# EAGLE design BSK1 (EAGLE 9.4.2)
ESKD_DESCRIPTION1: 207|235|224|242|224|32|193|209|202|49; ESKD_DESCRIPTION2: 241|245|229|236|224|32|253|235|229|234|242|240|232|247|229|241|234|224|255; ESKD_DESCRIPTION3: 239|240|232|237|246|232|239|232|224|235|252|237|224|255; ESKD_NUMBER: 67|67|83|50|46|50|50|48|48|45|48|221|51; ESKD_NUMBER_SHEET: 49; ESKD_SHEETS: 49
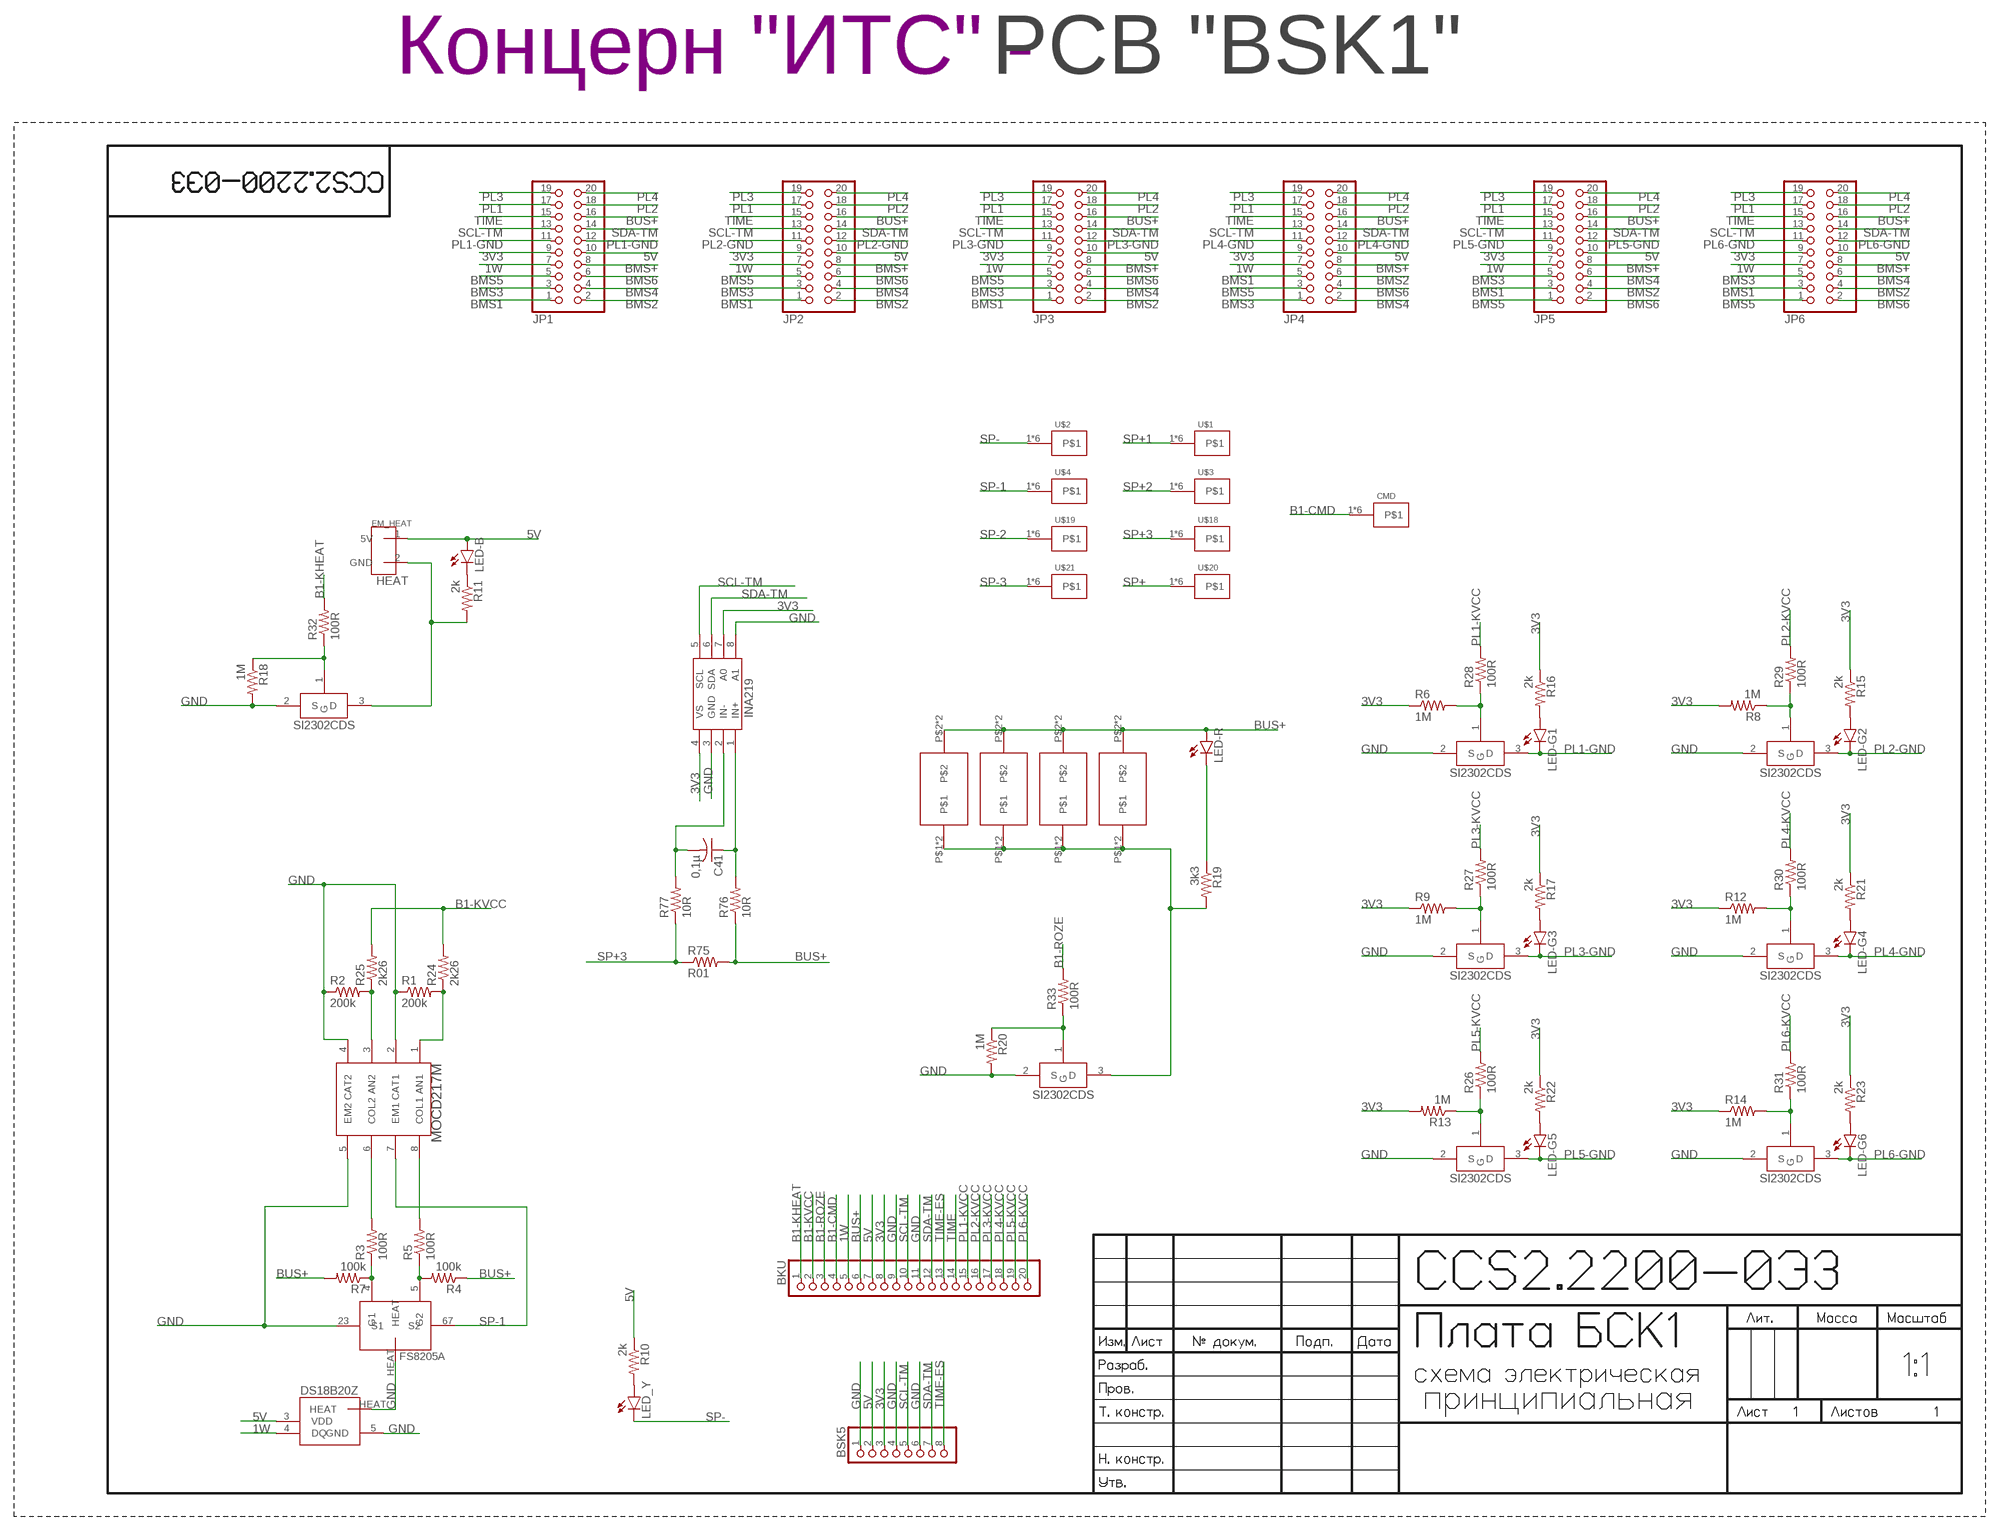
[diagram p0: schematic, sheet 1]

## Parts
BKU  PINHD-1X20  [1X20]
BSK5  PINHD-1X8  [1X08]
C41  0,1µ  C-USC0603  [C0603]
CMD  KCONNECTQUAD  [KCONNECT_QUAD]
DS18B20Z  DS18B20Z  [SOIC8+HEAT_S]
FS8205  FS8205A+  [FS8205A+]
INA  INA219AID  [SOT23-8]
JP1  PINHD-2X10  [2X10]
JP2  PINHD-2X10  [2X10]
JP3  PINHD-2X10  [2X10]
JP4  PINHD-2X10  [2X10]
JP5  PINHD-2X10  [2X10]
JP6  PINHD-2X10  [2X10]
LED-B  LEDCHIPLED_0603  [CHIPLED_0603]
LED-G1  LEDCHIPLED_0603  [CHIPLED_0603]
LED-G2  LEDCHIPLED_0603  [CHIPLED_0603]
LED-G3  LEDCHIPLED_0603  [CHIPLED_0603]
LED-G4  LEDCHIPLED_0603  [CHIPLED_0603]
LED-G5  LEDCHIPLED_0603  [CHIPLED_0603]
LED-G6  LEDCHIPLED_0603  [CHIPLED_0603]
LED-R  LEDCHIPLED_0603  [CHIPLED_0603]
LED_Y  LAP4-BOTTOM  [P47F-BOTTOM]
R1  200k  R-US_R0603  [R0603]
R2  200k  R-US_R0603  [R0603]
R3  100R  R-US_R0603  [R0603]
R4  100k  R-US_R0603  [R0603]
R5  100R  R-US_R0603  [R0603]
R6  1M  R-US_R0603  [R0603]
R7  100k  R-US_R0603  [R0603]
R8  1M  R-US_R0603  [R0603]
R9  1M  R-US_R0603  [R0603]
R10  2k  R-US_R0603  [R0603]
R11  2k  R-US_R0603  [R0603]
R12  1M  R-US_R0603  [R0603]
R13  1M  R-US_R0603  [R0603]
R14  1M  R-US_R0603  [R0603]
R15  2k  R-US_R0603  [R0603]
R16  2k  R-US_R0603  [R0603]
R17  2k  R-US_R0603  [R0603]
R18  1M  R-US_R0603  [R0603]
R19  3k3  R-US_R0603  [R0603]
R20  1M  R-US_R0603  [R0603]
R21  2k  R-US_R0603  [R0603]
R22  2k  R-US_R0603  [R0603]
R23  2k  R-US_R0603  [R0603]
R24  2k26  R-US_R0603  [R0603]
R25  2k26  R-US_R0603  [R0603]
R26  100R  R-US_R0603  [R0603]
R27  100R  R-US_R0603  [R0603]
R28  100R  R-US_R0603  [R0603]
R29  100R  R-US_R0603  [R0603]
R30  100R  R-US_R0603  [R0603]
R31  100R  R-US_R0603  [R0603]
R32  100R  R-US_R0603  [R0603]
R33  100R  R-US_R0603  [R0603]
R75  R01  R-US_R2512  [R2512]
R76  10R  R-US_R0603  [R0603]
R77  10R  R-US_R0603  [R0603]
SI2302-1  SI2302CDS  [SOT23-3]
SI2302-2  SI2302CDS  [SOT23-3]
SI2302-3  SI2302CDS  [SOT23-3]
SI2302-4  SI2302CDS  [SOT23-3]
SI2302-5  SI2302CDS  [SOT23-3]
SI2302-6  SI2302CDS  [SOT23-3]
SI2302-7  SI2302CDS  [SOT23-3]
SI2302-8  SI2302CDS  [SOT23-3]
U$1  KCONNECT  [KCONNECT]
U$2  KCONNECT  [KCONNECT]
U$3  KCONNECT  [KCONNECT]
U$4  KCONNECT  [KCONNECT]
U$18  KCONNECT  [KCONNECT]
U$19  KCONNECT  [KCONNECT]
U$20  KCONNECT  [KCONNECT]
U$21  KCONNECT  [KCONNECT]
U$22  MOCD  MOCD217M  [SOIC8]
U$24  EM_HEAT  [EM_HEAT]
U$26  PCB "BSK1"  ITS-LOGOPCB-""  [ITS-LOGO]
U$27  GRAFITGRAFIT4_2  [GRAFIT4_2]
U$28  GRAFITGRAFIT4_2  [GRAFIT4_2]
U$29  GRAFITGRAFIT4_2  [GRAFIT4_2]
U$30  GRAFITGRAFIT4_2  [GRAFIT4_2]

## Nets
1W: BKU.5 DS18B20Z.4(DQ) JP1.7 JP2.7 JP3.7 JP4.7 JP5.7 JP6.7
3: R11.2 SI2302-1.3(D) U$24.2(GND)
3V3: BKU.8 BSK5.3 INA.4(VS) INA.7(A0) JP1.9 JP2.9 JP3.9 JP4.9 JP5.9 JP6.9 R6.1 R8.2 R9.1 R12.1 R13.2 R14.1 R15.1 R16.1 R17.1 R21.1 R22.1 R23.1
4: R19.2 SI2302-2.3(D) U$27.P$1 U$27.P$4 U$28.P$1 U$28.P$4 U$29.P$1 U$29.P$4 U$30.P$1 U$30.P$4
5V: BKU.7 BSK5.2 DS18B20Z.3(VDD) JP1.10 JP2.10 JP3.10 JP4.10 JP5.10 JP6.10 LED-B.A R10.1 U$24.1(5V)
B1-CMD: BKU.4 CMD.1 CMD.2 CMD.3 CMD.4 CMD.P$1 CMD.P$2
B1-KHEAT: BKU.1 R32.2
B1-KVCC: BKU.2 R24.2 R25.2
B1-ROZE: BKU.3 R33.2
BMS1: JP1.1 JP2.1 JP3.1 JP4.5 JP5.3 JP6.3
BMS2: JP1.2 JP2.2 JP3.2 JP4.6 JP5.4 JP6.4
BMS3: JP1.3 JP2.3 JP3.3 JP4.1 JP5.5 JP6.5
BMS4: JP1.4 JP2.4 JP3.4 JP4.2 JP5.6 JP6.6
BMS5: JP1.5 JP2.5 JP3.5 JP4.3 JP5.1 JP6.1
BMS6: JP1.6 JP2.6 JP3.6 JP4.4 JP5.2 JP6.2
BMS+: JP1.8 JP2.8 JP3.8 JP4.8 JP5.8 JP6.8
BUS+: BKU.6 JP1.16 JP2.16 JP3.16 JP4.16 JP5.16 JP6.16 LED-R.A R4.1 R7.2 R75.2 R76.1 U$27.P$2 U$27.P$5 U$28.P$2 U$28.P$5 U$29.P$2 U$29.P$5 U$30.P$2 U$30.P$5
GND: BKU.9 BKU.11 BSK5.1 BSK5.4 BSK5.6 DS18B20Z.5(GND) DS18B20Z.HEAT FS8205.23(S1) FS8205.HEAT INA.3(GND) INA.8(A1) R1.1 R2.1 R18.2 R20.2 SI2302-1.2(S) SI2302-2.2(S) SI2302-3.2(S) SI2302-4.2(S) SI2302-5.2(S) SI2302-6.2(S) SI2302-7.2(S) SI2302-8.2(S) U$22.2(CAT1) U$22.4(CAT2) U$22.5(EM2)
N$1: FS8205.5(G2) R4.2 R5.1
N$2: LED-B.C R11.1
N$3: LED-R.C R19.1
N$4: LED-G1.A R16.2
N$21: LED-G3.A R17.2
N$22: LED-G4.A R21.2
N$23: LED-G5.A R22.2
N$24: LED-G6.A R23.2
N$25: R1.2 R24.1 U$22.1(AN1)
N$26: R2.2 R25.1 U$22.3(AN2)
N$27: FS8205.4(G1) R3.1 R7.1
N$28: LED_Y.A R10.2
N$29: R13.1 R26.1 SI2302-4.1(G)
N$30: R9.2 R27.1 SI2302-6.1(G)
N$31: R6.2 R28.1 SI2302-8.1(G)
N$32: R14.2 R31.1 SI2302-3.1(G)
N$34: R8.1 R29.1 SI2302-7.1(G)
N$35: R12.2 R30.1 SI2302-5.1(G)
N$36: R18.1 R32.1 SI2302-1.1(G)
N$37: R20.1 R33.1 SI2302-2.1(G)
N$38: LED-G2.A R15.2
N$150: C41.1 INA.1(IN+) R76.2
N$151: C41.2 INA.2(IN-) R77.2
OC2: R3.2 U$22.6(COL2)
OD2: R5.2 U$22.8(COL1)
PL1: JP1.17 JP2.17 JP3.17 JP4.17 JP5.17 JP6.17
PL1-GND: JP1.11 JP1.12 LED-G1.C SI2302-8.3(D)
PL1-KVCC: BKU.15 R28.2
PL2: JP1.18 JP2.18 JP3.18 JP4.18 JP5.18 JP6.18
PL2-GND: JP2.11 JP2.12 LED-G2.C SI2302-7.3(D)
PL2-KVCC: BKU.16 R29.2
PL3: JP1.19 JP2.19 JP3.19 JP4.19 JP5.19 JP6.19
PL3-GND: JP3.11 JP3.12 LED-G3.C SI2302-6.3(D)
PL3-KVCC: BKU.17 R27.2
PL4: JP1.20 JP2.20 JP3.20 JP4.20 JP5.20 JP6.20
PL4-GND: JP4.11 JP4.12 LED-G4.C SI2302-5.3(D)
PL4-KVCC: BKU.18 R30.2
PL5-GND: JP5.11 JP5.12 LED-G5.C SI2302-4.3(D)
PL5-KVCC: BKU.19 R26.2
PL6-GND: JP6.11 JP6.12 LED-G6.C SI2302-3.3(D)
PL6-KVCC: BKU.20 R31.2
SCL-TM: BKU.10 BSK5.5 INA.5(SCL) JP1.13 JP2.13 JP3.13 JP4.13 JP5.13 JP6.13
SDA-TM: BKU.12 BSK5.7 INA.6(SDA) JP1.14 JP2.14 JP3.14 JP4.14 JP5.14 JP6.14
SP+: U$20.1 U$20.2 U$20.3 U$20.4 U$20.P$1 U$20.P$2
SP+1: U$1.1 U$1.2 U$1.3 U$1.4 U$1.P$1 U$1.P$2
SP+2: U$3.1 U$3.2 U$3.3 U$3.4 U$3.P$1 U$3.P$2
SP+3: R75.1 R77.1 U$18.1 U$18.2 U$18.3 U$18.4 U$18.P$1 U$18.P$2
SP-: LED_Y.C U$2.1 U$2.2 U$2.3 U$2.4 U$2.P$1 U$2.P$2
SP-1: FS8205.67(S2) U$4.1 U$4.2 U$4.3 U$4.4 U$4.P$1 U$4.P$2 U$22.7(EM1)
SP-2: U$19.1 U$19.2 U$19.3 U$19.4 U$19.P$1 U$19.P$2
SP-3: U$21.1 U$21.2 U$21.3 U$21.4 U$21.P$1 U$21.P$2
TIME: BKU.14 JP1.15 JP2.15 JP3.15 JP4.15 JP5.15 JP6.15
TIME-ES: BKU.13 BSK5.8

## Notes on the sheet
- HEAT

## Library data of the parts
BKU = pinheadCS:PINHD-1X20: PIN HEADER
BSK5 = pinheadCS:PINHD-1X8: PIN HEADER
C41 = rcl:C-US: CAPACITOR, American symbol; SPICEPREFIX: C
CMD U$1-U$4 U$18-U$21 = CanCubeSat:KCONNECT
DS18B20Z = CanCubeSat:DS18B20Z
FS8205 = CanCubeSat:FS8205A+
INA = CanCubeSat:INA219AID
JP1-JP6 = pinheadCS:PINHD-2X10: PIN HEADER
LED-B LED-G1-LED-G6 LED-R = led:LED: LED OSRAM: - CHIPLED LG R971, LG N971, LY N971, LG Q971, LY Q971, LO R971, LY R971 LH N974, LH R974 LS Q976, LO Q976, LY Q976 LO Q996 - Hyper CHIPLED LW Q18S LB Q993, LB Q99A, LB R99A - SideLED LS A670, LO A670, LY A670, LG A670, LP A670 LB A673, LV A673, LT A673, LW A673 LH A674 LY A675 LS A676, LA A676, LO A676, LY A676, LW A676 LS A679, LY A679, LG A679 - Hyper Micro SIDELED® LS Y876, LA Y876, LO Y876, LY Y876 LT Y87S - SmartLED LW L88C, LW L88S LB L89C, LB L89S, LG L890 LS L89K, LO L89K, LY L89K LS L896, LA L896, LO L896, LY L896 - TOPLED LS T670, LO T670, LY T670, LG T670, LP T670 LSG T670, LSP T670, LSY T670, LOP T670, LYG T670 LG T671, LOG T671, LSG T671 LB T673, LV T673, LT T673, LW T673 LH T674 LS T676, LA T676, LO T676, LY T676, LB T676, LH T676, LSB T676, LW T676 LB T67C, LV T67C, LT T67C, LS T67K, LO T67K, LY T67K, LW E67C LS E67B, LA E67B, LO E67B, LY E67B, LB E67C, LV E67C, LT E67C LW T67C LS T679, LY T679, LG T679 LS T770, LO T770, LY T770, LG T770, LP T770 LB T773, LV T773, LT T773, LW T773 LH T774 LS E675, LA E675, LY E675, LS T675 LS T776, LA T776, LO T776, LY T776, LB T776 LHGB T686 LT T68C, LB T68C - Hyper Mini TOPLED® LB M676 - Mini TOPLED Santana® LG M470 LS M47K, LO M47K, LY M47K Source: http://www.osram.convergy.de LUXEON: - LUMILED® LXK2-PW12-R00, LXK2-PW12-S00, LXK2-PW14-U00, LXK2-PW14-V00 LXK2-PM12-R00, LXK2-PM12-S00, LXK2-PM14-U00 LXK2-PE12-Q00, LXK2-PE12-R00, LXK2-PE12-S00, LXK2-PE14-T00, LXK2-PE14-U00 LXK2-PB12-K00, LXK2-PB12-L00, LXK2-PB12-M00, LXK2-PB14-N00, LXK2-PB14-P00, LXK2-PB14-Q00 LXK2-PR12-L00, LXK2-PR12-M00, LXK2-PR14-Q00, LXK2-PR14-R00 LXK2-PD12-Q00, LXK2-PD12-R00, LXK2-PD12-S00 LXK2-PH12-R00, LXK2-PH12-S00 LXK2-PL12-P00, LXK2-PL12-Q00, LXK2-PL12-R00 Source: www.luxeon.com KINGBRIGHT: KA-3528ASYC Source: www.kingbright.com
LED_Y = led:*P4: PointLED® Enhanced Thinfilm LED TOP & BOTTOM mount LS P47F, LR P47F, LA P47F, LY P47F, LT P4SG, LB P4SG, LW P4SG Source: http://catalog.osram-os.com .. LA_LR_LS_LY_P47F_Pb_free.pdf
R1-R33 R76 R77 = resistor:R-US_: RESISTOR, American symbol
R75 = rcl:R-US_: RESISTOR, American symbol; SPICEPREFIX: R
SI2302-1-SI2302-8 = CanCubeSat:SI2302CDS
U$22 = CanCubeSat:MOCD217M
U$24 = CanCubeSat:EM_HEAT
U$26 = CanCubeSat:ITS-LOGO
U$27-U$30 = CanCubeSat:GRAFIT

## Board
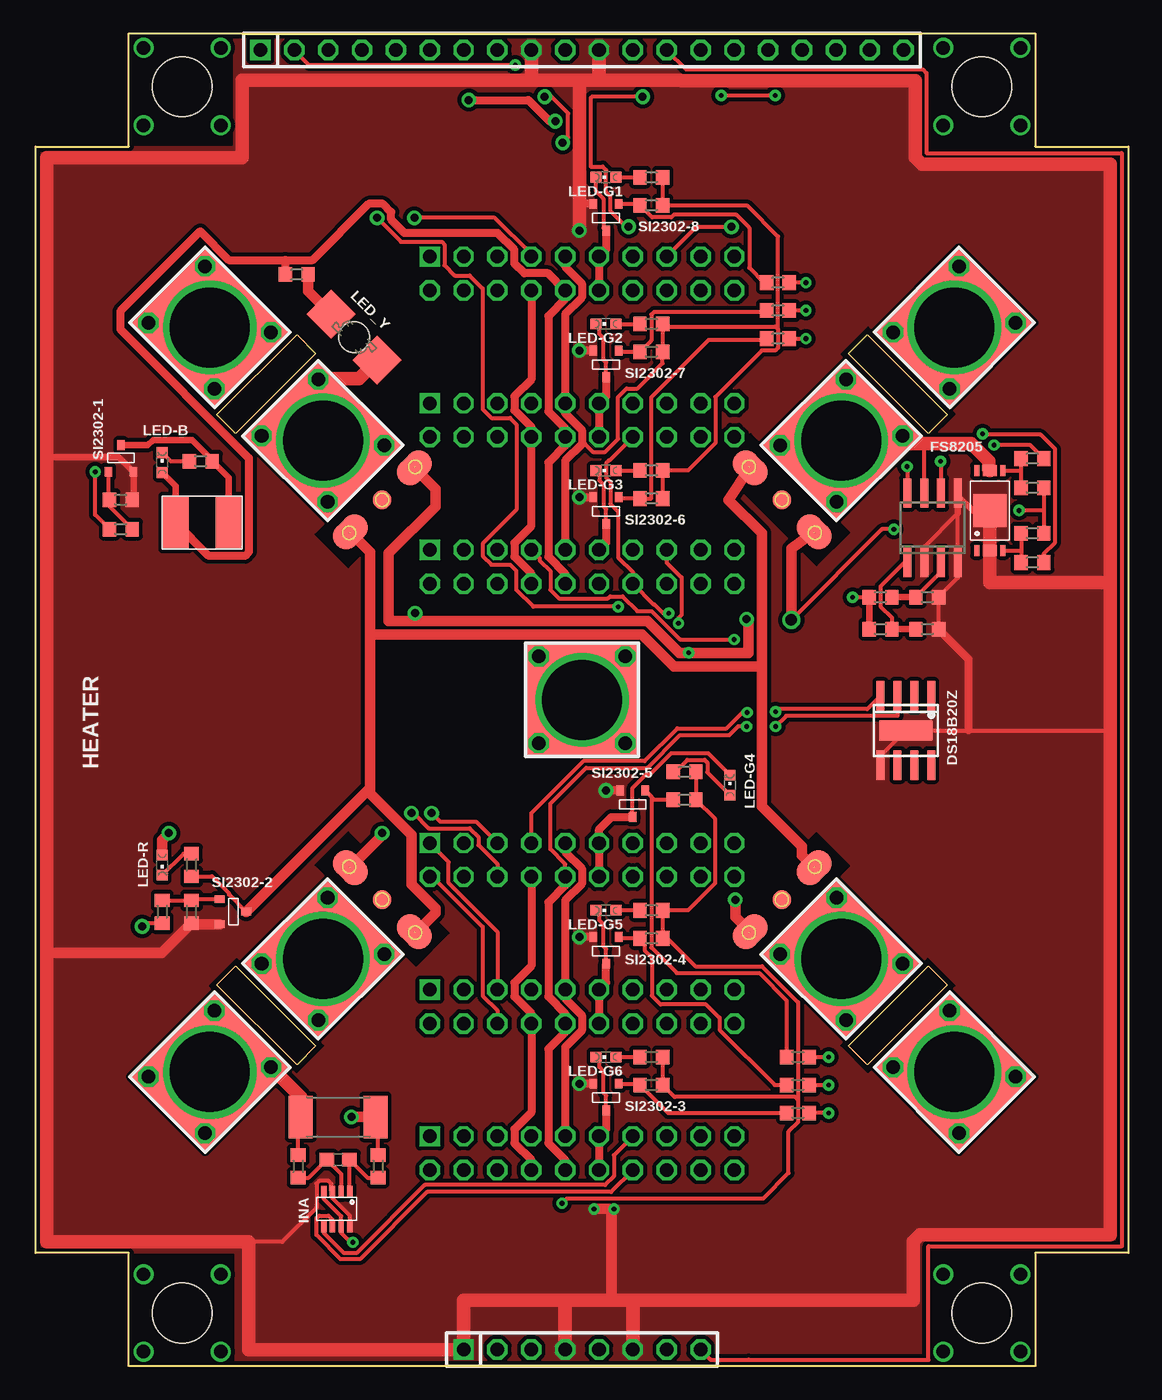
[diagram p1: board, top side]
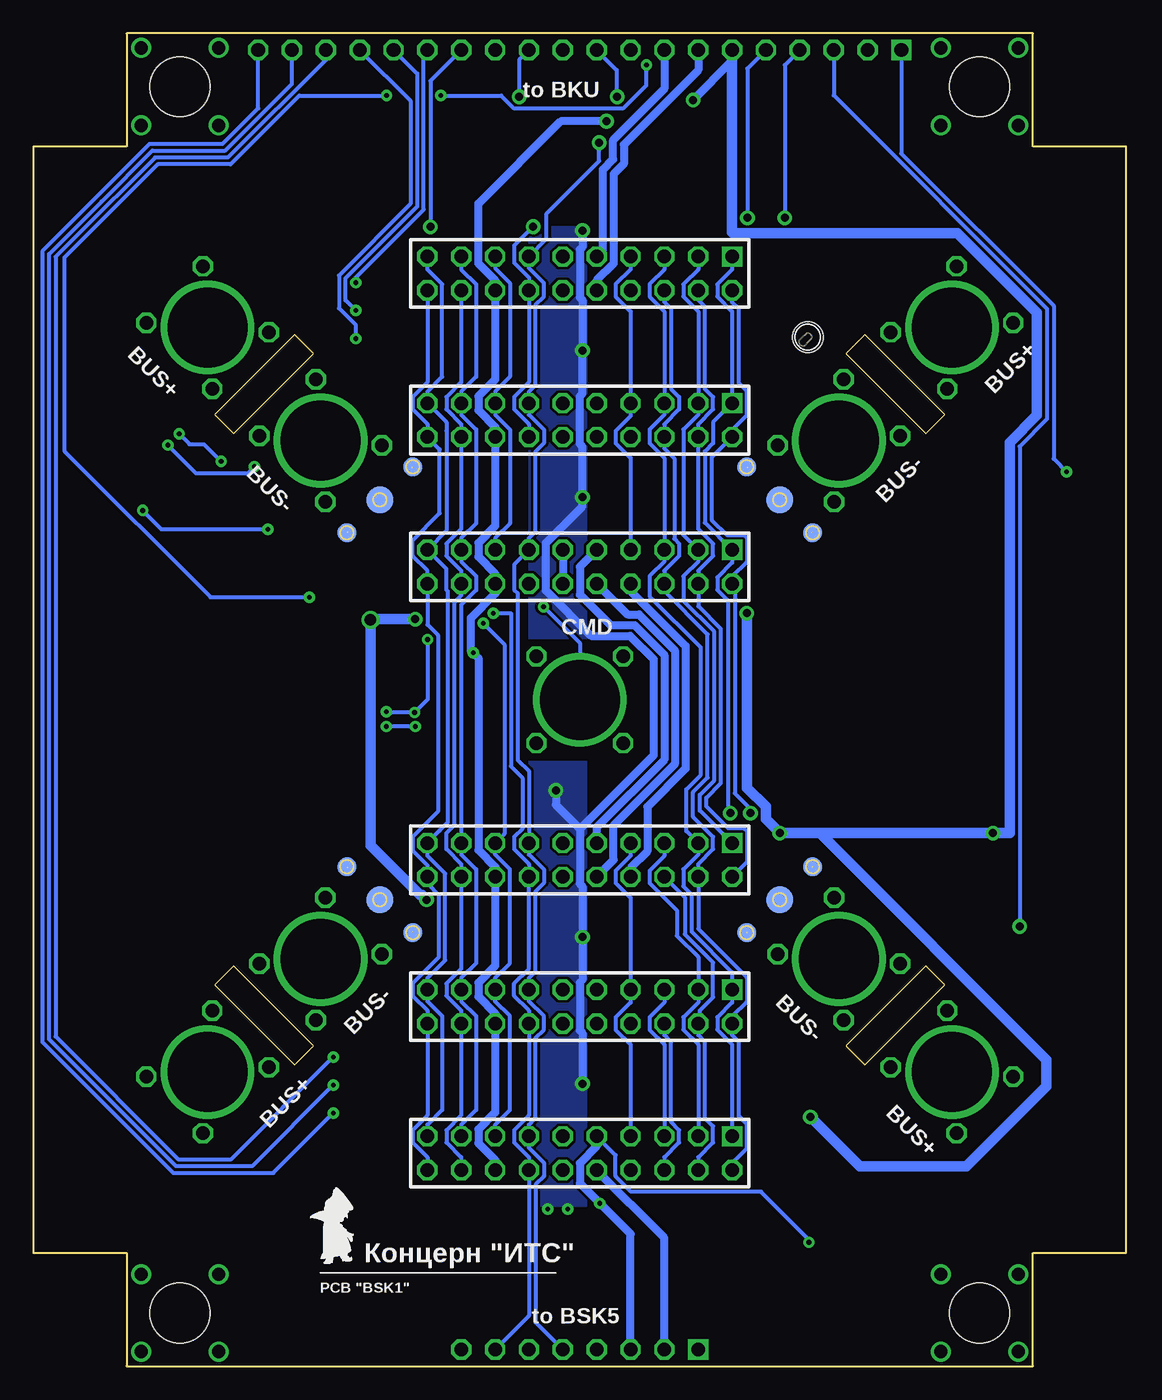
[diagram p2: board, bottom side, seen from below]

Size 82 x 100 mm. Coordinates in mm from the lower left corner, seen from the top.
Outline: 0,8.5 0,91.5 7,91.5 7,100 75,100 75,91.5 82,91.5 82,8.5 75,8.5 75,0 7,0 7,8.5 0,8.5
Outline: 60.98,24.01 66.99,30.02 68.4,28.61 62.39,22.6 60.98,24.01
Outline: 13.6,71.39 19.61,77.4 21.02,75.99 15.01,69.98 13.6,71.39
Outline: 66.99,69.98 60.98,75.99 62.39,77.4 68.4,71.39 66.99,69.98
Outline: 19.61,22.6 13.6,28.61 15.01,30.02 21.02,24.01 19.61,22.6
Copper layers (1*16): Top 0.035mm / dielectric 1.5mm / Bottom 0.035mm
Design rules "default *": minimum track width 0.3mm, minimum drill 0.35mm, track to track 0.2mm, track to pad 0.2mm, pad to pad 0.2mm, via to via 0.2mm, smd to smd 0.2mm, copper to edge 0.25mm, drill to drill 8mil, minimum pad ring 0.25mm, minimum via ring 0.25mm, stop-mask expansion 2mil, vias tented up to drill 0mil, thermal gap 10mil
Holes 4.5 mm at 11,4 71,4 71,96 11,96

### Footprints (pad centres in the part's own frame; a part is rotated, then mirrored left to right if it is on the bottom)
1X20 = drill 1.016 square: 1 -24.13,0 | drill 1.016 octagon: 2 -21.59,0; 3 -19.05,0; 4 -16.51,0; 5 -13.97,0; 6 -11.43,0; 7 -8.89,0; 8 -6.35,0; 9 -3.81,0; 10 -1.27,0; 11 1.27,0; 12 3.81,0; 13 6.35,0; 14 8.89,0; 15 11.43,0; 16 13.97,0; 17 16.51,0; 18 19.05,0; 19 21.59,0; 20 24.13,0
1X08 = drill 1.016 square: 1 -8.89,0 | drill 1.016 octagon: 2 -6.35,0; 3 -3.81,0; 4 -1.27,0; 5 1.27,0; 6 3.81,0; 7 6.35,0; 8 8.89,0
C0603 = smd 1.1 x 1: 1 -0.85,0; 2 0.85,0
KCONNECT_QUAD = drill 1.016 octagon: 1 -3.25,-3.25; 2 -3.25,3.25; 3 3.25,-3.25; 4 3.25,3.25 | drill 6: P$1 0,0 | smd 8.5 x 8.5: P$2 0,0
SOIC8+HEAT_S = smd 0.6 x 2.2: 1 -1.905,-2.6; 2 -0.635,-2.6; 3 0.635,-2.6; 4 1.905,-2.6; 5 1.905,2.6; 6 0.635,2.6; 7 -0.635,2.6; 8 -1.905,2.6 | smd 4 x 1.5: HEAT 0,0
FS8205A+ = smd 0.4 x 0.8: 1 -0.975,-3; 4 0.975,-3; 5 0.975,3; 8 -0.975,3 | smd 1.05 x 0.8: 23 0,-3; 67 0,3 | smd 2.5 x 2.5: HEAT 0,0
SOT23-8 = smd 0.9 x 0.4: 1 -1.3,0.975; 2 -1.3,0.325; 3 -1.3,-0.325; 4 -1.3,-0.975; 5 1.3,-0.975; 6 1.3,-0.325; 7 1.3,0.325; 8 1.3,0.975
2X10 = drill 1.016 square: 1 -11.43,-1.27 | drill 1.016 octagon: 2 -11.43,1.27; 3 -8.89,-1.27; 4 -8.89,1.27; 5 -6.35,-1.27; 6 -6.35,1.27; 7 -3.81,-1.27; 8 -3.81,1.27; 9 -1.27,-1.27; 10 -1.27,1.27; 11 1.27,-1.27; 12 1.27,1.27; 13 3.81,-1.27; 14 3.81,1.27; 15 6.35,-1.27; 16 6.35,1.27; 17 8.89,-1.27; 18 8.89,1.27; 19 11.43,-1.27; 20 11.43,1.27
CHIPLED_0603 = smd 0.8 x 0.8: A 0,-0.75; C 0,0.75
P47F-BOTTOM = smd 2.6 x 2.6: A -2.45,0; C 2.45,0 | hole 2.3: 0,0
R0603 = smd 1 x 1.1: 1 -0.85,0; 2 0.85,0
R2512 = smd 1.8 x 3.2: 1 -2.8,0; 2 2.8,0
SOT23-3 = smd 0.56 x 0.73: 1 -0.95,-1; 2 0.95,-1; 3 0,1
KCONNECT = drill 1.016 octagon: 1 -3,-3.5; 2 -3,3.5; 3 3,-3.5; 4 3,3.5 | drill 6: P$1 0,0 | smd 8 x 9: P$2 0,0
SOIC8 = smd 0.6 x 2.2: 1 -1.905,-2.6; 2 -0.635,-2.6; 3 0.635,-2.6; 4 1.905,-2.6; 5 1.905,2.6; 6 0.635,2.6; 7 -0.635,2.6; 8 -1.905,2.6
EM_HEAT = smd 2 x 4: 1 -2,0; 2 2,0
GRAFIT4_2 = smd 2 x 2 bottom: OUT 0,0 | smd 2 x 2.9: P$1 0,3.4; P$2 0,-3.4 | smd 1.4 x 1.4: P$3 0,0 | smd 1.4 x 1.4 bottom: P$4 0,3.5; P$5 0,-3.5

### Placement (x,y rotation side)
BKU  41,98.75 0 top
BSK5  41,1.25 0 top
C41  22.7,15.5 180 top
CMD  41,50 0 top
DS18B20Z  65.3,47.7 180 top
FS8205  71.6,64.2 0 top
INA  22.6,11.8 270 top
JP1  41,81.98 180 bottom
JP2  41,70.98 180 bottom
JP3  41,59.98 180 bottom
JP4  41,37.98 180 bottom
JP5  41,26.98 180 bottom
JP6  41,15.98 180 bottom
LED-B  9.5,67.8 0 top
LED-G1  42.8,89.2 90 top
LED-G2  42.8,78.2 90 top
LED-G3  42.8,67.2 90 top
LED-G4  52.1,43.6 0 top
LED-G5  42.8,34.2 90 top
LED-G6  42.8,23.2 90 top
LED-R  9.5,37.6 180 top
LED_Y  23.9,77.2 315 top
R1  66.9,55.3 180 top
R2  66.9,57.7 180 top
R3  74.8,60.3 0 top
R4  74.8,65.9 180 top
R5  74.8,68.1 0 top
R6  46.2,87.1 180 top
R7  74.8,62.5 0 top
R8  46.2,76.1 0 top
R9  46.2,65.1 180 top
R10  19.6,81.9 0 top
R11  12.4,67.9 0 top
R12  48.7,42.5 180 top
R13  46.2,32.1 0 top
R14  46.2,21.1 180 top
R15  46.2,78.2 180 top
R16  46.2,89.2 180 top
R17  46.2,67.2 180 top
R18  6.4,65 0 top
R19  11.7,37.6 270 top
R20  11.7,34.1 270 top
R21  48.7,44.6 180 top
R22  46.2,34.2 180 top
R23  46.2,23.2 180 top
R24  63.4,55.3 180 top
R25  63.4,57.7 180 top
R26  57.2,21.1 0 top
R27  55.7,77.1 0 top
R28  55.7,81.3 0 top
R29  55.7,79.2 0 top
R30  57.2,23.2 0 top
R31  57.2,19 0 top
R32  6.4,62.8 180 top
R33  9.5,34.1 270 top
R75  22.7,18.7 0 top
R76  25.7,15 270 top
R77  19.7,15 270 top
SI2302-1  6.4,68.1 0 top
SI2302-2  14.8,34.1 270 top
SI2302-3  42.8,20.2 180 top
SI2302-4  42.8,31.2 180 top
SI2302-5  44.8,42.2 180 top
SI2302-6  42.8,64.2 180 top
SI2302-7  42.8,75.2 180 top
SI2302-8  42.8,86.2 180 top
U$1  13.07,77.93 45 top
U$2  21.55,69.44 45 top
U$3  68.93,77.93 315 top
U$4  60.45,69.44 315 top
U$18  13.07,22.07 135 top
U$19  21.55,30.55 135 top
U$20  68.93,22.07 225 top
U$21  60.45,30.55 225 top
U$22  67.3,62.9 0 top
U$24  12.5,63.3 0 top
U$26  60.5,7 0 bottom
U$27  56,65 45 top
U$28  26,35 225 top
U$29  26,65 135 top
U$30  56,35 315 top

### Tracks (layer width: path | path; a pad name or v marks a point on that pad's centre or on a via)
1W  (via drill 0.35 pad 0.65, 0.6 pad 0.65)
  Top 0.3: v28.42,86.15 28.43,86.16 34.44,86.16 37.19,83.41 JP1.7 | JP4.7 37.19,41.49 41.1,45.4 45.69,45.4 48.14,47.85 51.85,47.85 53.05,49.05 v53.4,49.05 | v55.52,49.1 55.52,49.21 55.62,49.3 62.4,49.3 DS18B20Z.4 | JP3.7 37.82,60.62 37.82,60.46 38.62,59.66 38.62,58.25 39.27,57.6 42.94,57.6 43.09,57.76 44.04,57.76 45.15,56.65 46.23,56.65 48.35,54.52 v52.41,54.52
  Bottom 0.3: JP1.7 37.19,82.28 38.3,81.17 38.3,80.25 37.19,79.14 JP2.7 37.19,71.28 38.3,70.17 38.3,69.25 37.19,68.14 JP3.7 | JP4.7 37.19,38.28 38.3,37.17 38.3,36.25 37.19,35.14 JP5.7 37.19,27.28 38.3,26.17 38.3,25.25 37.19,24.14 JP6.7 | BKU.5 28.42,97.36 v28.42,86.15 | v55.52,49.1 55.48,49.05 v53.4,49.05 52.41,50.03 v52.41,54.52
3
  Top 0.5: U$24.2 14.5,66.65 R11.2 13.25,68 11.75,69.5 8.81,69.5 8.41,69.1 SI2302-1.3
3V3  (via drill 0.35, 0.35 pad 0.65)
  Top 0.3: INA.4 21.62,12.55 22.93,11.25 INA.7 22.93,10.01 23.63,9.3 v23.8,9.3 | R9.1 R17.1 48.95,67.2 51,69.25 51,72.71 54.49,76.2 55.49,76.2 55.7,76.41 55.7,77.8 | R16.1 R6.1 53.35,87.1 55.7,84.75 55.7,77.8 | R21.1 R12.1 51,41.05 51,36.25 48.95,34.2 R22.1 R13.2 47.4,32.1 49.5,30 54.5,30 57.2,27.3 57.2,20 | R23.1 R14.1 47.95,20.2 57,20.2 57.2,20 | 55.7,77.8 55.49,78 47.25,78 R15.1 R8.2 47.05,75.25 45.17,73.36 44.35,73.36 43.7,72.71 43.7,69.56 42.73,68.6 41.81,68.6 41.22,69.19 40.99,69.19 | 57.2,20 57.2,18.3 56.5,17.61 56.5,14.5 54.58,12.57 39.85,12.57 v39.5,12.22
  Top 0.6: JP3.9 39.73,67.92 40.99,69.19 40.99,70.23 39.73,71.5 JP2.9 39.73,78.92 40.99,80.19 40.99,81.23 39.73,82.5 JP1.9 | JP4.9 39.73,38.6 40.99,37.34 40.99,36.19 39.73,34.92 JP5.9 39.73,27.6 40.99,26.34 40.99,25.19 39.73,23.93 JP6.9
  Bottom 0.3: v23.8,9.3 23.8,9.5 27.4,13.1 37.15,13.1 38.3,14.25 38.3,15.82 JP6.9
  Bottom 0.6: JP3.9 41,59.98 41,57.89 38.71,55.6 36.89,55.6 34.66,53.37 34.66,45.5 39.73,40.43 JP4.9 | BKU.8 34.65,95.84 38.5,91.99 38.5,90.55 39.27,89.78 39.27,83.71 JP1.9 | BSK5.3 37.19,9.91 v39.5,12.22 40.99,13.71 40.99,15.23 39.73,16.5 JP6.9
4  (4 unrouted)
  Top 0.3: SI2302-2.3 14.52,35.38 14.52,35.48 13.24,36.75 R19.2
  Top 0.8: 25.1,54.9 25.1,43.4 | SI2302-2.3 25.1,43.4 | U$29.P$1 25.1,61.1 25.1,54.9 | U$28.P$1 arc45 28.73,32.73 30,34 30,34.35 28.21,36.15 28.21,39.87 25.1,42.98 25.1,43.4 | 25.1,54.9 45.5,54.9 47.9,52.5 54.5,52.5 | 54.5,52.5 54.5,62.5 52,65 U$27.P$1 | 54.5,52.5 54.5,42 57.5,39 57.5,38.31 U$30.P$1
5V  (via drill 0.35 pad 0.65)
  Top 0.3: JP4.10 39.73,37.68 38.62,38.79 38.62,42.21 41.31,44.9 45.9,44.9 48.35,47.35 52.06,47.35 52.71,48 v53.35,48 | DS18B20Z.3 64.67,48.8 56.33,48.8 v55.52,48
  Top 0.5: LED-B.A 10.5,66.05 U$24.1
  Top 0.6: JP3.10 39.73,59.47 38.47,60.73 38.47,67.8 39.73,69.06 JP2.10 39.73,70.36 38.47,71.62 38.47,78.8 39.73,80.06 JP1.10 38.45,81.99 36.67,81.99 35.93,82.73 35.93,83.76 34.67,85.01 27.68,85.01 26.67,86.02 26.67,86.58 26.05,87.2 25,87.2 20.8,83 18.75,83 | JP4.10 39.73,36.06 38.47,34.8 38.47,27.73 39.73,26.46 JP5.10 39.73,25.06 38.47,23.8 38.47,16.73 39.73,15.46 JP6.10 | R10.1 18.75,83 | U$24.1 13,60.8 15.71,60.8 16,61.09 16,68.15 6.35,77.8 6.35,79.15 12.35,85.15 14.5,83 18.75,83
  Bottom 0.3: v53.35,48 v55.52,48
  Bottom 0.6: JP4.10 38.45,37.99 38.45,40.58 33.86,45.17 33.86,53.7 36.56,56.4 37.42,56.4 JP3.10 | BKU.7 32.11,97.25 37.7,91.66 37.7,90.22 38.47,89.45 38.47,82.73 39.73,81.47 JP1.10 | BSK5.2 34.65,9.63 JP6.10
B1-CMD  (via drill 0.35 pad 0.65, 0.6 pad 0.65)
  Top 0.3: CMD.P$1 CMD.2 | 41.08,49.92 CMD.3 | 41.08,49.92 43.94,52.78 CMD.4 | 41.08,49.92 CMD.P$1 | v25.62,86.15 27.41,84.36 30.48,84.36 30.68,84.16 30.68,82.59 31.45,81.82 32.57,81.82 33.54,80.86 33.54,71.79 34.19,71.14 35.6,71.14 36.08,70.66 36.08,64.25 33.54,61.71 33.54,60.79 34.19,60.14 35.6,60.14 36.08,59.66 36.08,58.25 37.34,56.98 v43.72,56.98 | CMD.P$1 CMD.1
  Bottom 0.3: v43.72,56.98 41,54.27 CMD.P$1 | BKU.4 25.62,97.62 v25.62,86.15
B1-KHEAT  (via drill 0.35)
  Top 0.3: R32.2 4.46,63.88 v4.46,67.1
  Bottom 0.3: v4.46,67.1 5.44,68.08 5.44,79.55 16.87,90.98 BKU.1
B1-KVCC  (via drill 0.35 pad 0.65)
  Top 0.3: v55.5,95.33 v51.43,95.33 | v36,97.62 20.54,97.62 BKU.2 | v61.3,57.7 R25.2
  Top 0.5: R24.2 R25.2
  Bottom 0.3: v55.5,95.33 62.05,95.33 67.2,90.18 72.67,90.18 78.53,84.32 79.67,83.17 79.67,68.67 68.7,57.7 v61.3,57.7 | v51.43,95.33 46.9,95.33 45.92,94.35 37.77,94.35 36,96.12 v36,97.62
B1-ROZE  (via drill 0.6 pad 0.65)
  Top 0.3: v8,33 8.25,33.25 R33.2
  Bottom 0.3: BKU.3 21.95,95.35 5.94,79.34 5.94,71.06 8,69 v8,33
BMS1  (via drill 0.6 pad 0.65)
  Top 0.3: v29.71,41.5 30.35,40.86 33.04,40.86 JP4.5
  Bottom 0.3: JP1.1 29.57,82.28 30.68,81.17 30.68,80.25 29.57,79.14 JP2.1 31,70.82 31,69.25 31.61,68.64 31.61,63.29 JP3.1 29.57,60.28 30.68,59.17 30.68,58.25 29.87,57.44 29.87,41.66 v29.71,41.5 | JP4.5 34.65,38.28 35.76,37.17 35.76,36.25 33.72,34.21 33.72,32.3 32.11,30.69 JP5.3 32.11,27.28 33.22,26.17 33.22,25.25 32.11,24.14 JP6.3
BMS2  (via drill 0.6 pad 0.65)
  Top 0.3: JP4.6 34.65,37.68 33.22,39.1 33.22,39.71 32.57,40.36 29.5,40.36 28.36,41.5 v28.2,41.5
  Bottom 0.3: JP1.2 29.57,79.84 29.07,79.34 29.07,73.77 28.46,73.16 28.46,71.34 29.57,70.23 JP2.2 31.11,68.17 31.11,63.5 29.98,62.36 28.66,62.36 28.46,62.16 28.46,60.34 29.57,59.23 JP3.2 29.37,58.51 29.37,42.97 28.2,41.8 v28.2,41.5 | JP4.6 33.11,35.17 33.11,32.4 31,30.28 31,27.69 32,26.68 32,25.82 JP5.4 32.11,24.84 31.61,24.34 31.61,18.61 31,18 31,16.79 32.11,15.68 JP6.4
BMS3
  Top 0.3: JP5.5 34.65,32.6 31,36.25 31,37.82 JP4.1
  Bottom 0.3: JP1.3 32.11,82.28 33.22,81.17 33.22,80.25 32.11,79.14 JP2.3 32.11,71.39 33.22,70.27 33.22,62.36 JP3.3 32.11,60.38 33.22,59.27 33.22,57.42 30.91,55.11 30.91,43.95 32,42.86 32,41.68 JP4.1 | JP5.5 34.65,27.28 35.76,26.17 35.76,25.25 34.65,24.14 JP6.5
BMS4
  Top 0.3: JP4.2 29.79,36.71 33.54,32.96 33.54,27.79 34.65,26.68 JP5.6
  Bottom 0.3: JP1.4 32.11,80 31.61,79.5 31.61,73.32 31,72.71 31,71.79 32.11,70.68 JP2.4 32.11,62.82 31,61.71 31,60.79 32.11,59.68 JP3.4 32.11,57.02 30.41,55.32 30.41,43.74 31.5,42.65 31.5,42 29.86,40.36 28.66,40.36 28.46,40.16 28.46,37.82 JP4.2 | JP6.6 34.65,15.68 33.54,16.79 33.54,17.71 34.15,18.32 34.15,24.34 34.65,24.84 JP5.6
BMS5
  Bottom 0.3: JP1.5 34.65,82.28 35.76,81.17 35.76,80.25 34.65,79.14 JP2.5 34.65,71.39 35.76,70.27 35.76,69.25 34.65,68.14 JP3.5 34.65,60.38 35.76,59.27 35.76,57.76 31.91,53.91 31.91,44.36 33,43.27 33,40.14 JP4.3 32.11,38.38 33.22,37.27 33.22,36 32.61,35.39 32.61,32.6 29.57,29.56 JP5.1 29.57,27.28 30.68,26.17 30.68,25.25 29.57,24.14 JP6.1
BMS6
  Bottom 0.3: JP1.6 34.65,79.84 34.15,79.34 34.15,73.32 33.54,72.71 33.54,71.79 34.65,70.68 JP2.6 34.65,68.84 33.9,68.1 33.9,62.08 33.54,61.71 33.54,60.79 34.65,59.68 JP3.6 34.65,58.15 31.41,54.91 31.41,44.15 32.5,43.06 32.5,41.21 31,39.71 31,38.79 32.11,37.68 JP4.4 32.11,32.81 28.46,29.16 28.46,27.34 29.57,26.23 JP5.2 29.57,24.84 29.07,24.34 29.07,18.77 28.46,18.16 28.46,16.34 29.57,15.23 JP6.2
BMS+
  Top 0.6: JP3.8 37.19,59.47 35.93,60.73 35.93,61.77 37.19,63.03 JP2.8 37.19,70.47 35.93,71.73 35.93,72.77 37.19,74.03 JP1.8 | JP4.8 37.19,30.04 35.93,28.77 35.93,27.73 37.19,26.46 JP5.8 37.19,19.04 35.93,17.77 35.93,16.73 37.19,15.46 JP6.8
  Bottom 0.6: JP4.8 37.19,37.36 35.93,38.62 35.93,41.97 33.06,44.84 33.06,54.04 37.19,58.17 JP3.8
BUS+  (via drill 0.35, 0.6 pad 0.65, 0.85)  (4 unrouted)
  Top 0.3: R76.1 25.7,18.5 R75.2 | R4.1 75.65,64.2 | 75.65,64.2 R7.2 | 75.65,64.2 v73.8,64.2 | v64.4,62.8 63.5,62.8 v56.7,56
  Top 0.6: v32.5,95 36.97,95 38.56,93.4 v39,93.4
  Top 0.8: U$27.P$2 56.7,61.33 v56.7,56 | U$30.P$2 52.5,33.69 v52.5,35 | U$29.P$2 30,65.81 30,64.5 26.5,61 26.5,55.9 28.5,55.9 | U$28.P$2 26,39.81 v26,40 | v28.47,56.5 28.47,55.93 28.5,55.9 | LED-R.A 9.5,39.5 v10,40 | v23.7,18.7 R75.2 | v53.35,56.05 53.5,55.9 53.5,53.5 48.31,53.5 45.91,55.9 28.5,55.9
  Bottom 0.3: v73.8,64.2 72.4,62.8 v64.4,62.8
  Bottom 0.6: v32.5,95 29.57,97.93 BKU.6 | v39,93.4 42.44,93.4 48.61,87.23 48.61,82.73 47.35,81.47 JP1.16 47.35,74.03 48.61,72.77 48.61,71.73 47.35,70.47 JP2.16 47.35,63.03 48.61,61.77 48.61,60.73 47.35,59.47 JP3.16 47.35,57.96 49.16,56.15 49.16,53.69 v49,53.52 48.61,53.14 48.61,38.73 47.35,37.47 JP4.16 47.35,30.04 48.61,28.77 48.61,27.73 47.35,26.46 JP5.16 47.35,19.04 48.61,17.77 48.61,16.73 47.35,15.46 JP6.16
  Bottom 0.8: v52.5,35 52.85,35.35 52.99,35.35 56.7,39.05 v56.7,56 56.65,56.05 v53.35,56.05 | v28.47,56.5 28.47,43.4 27.05,41.98 27.05,41.05 v26,40 23,40 | BKU.6 29.57,85.07 29.5,85 12.66,85 6.69,79.03 6.69,71.37 8.75,69.31 8.75,40 v10,40 23,40 | 23,40 6,23 6,21 12,15 20,15 v23.7,18.7
GND  (via drill 0.35 pad 0.65, 0.6 pad 0.65)
  Top 0.3: INA.8 23.57,11.3 22.27,12.61 INA.3 22.18,13.2 22.18,13.7 21.97,13.9 21.28,13.9 21.07,13.7 21.07,11.9 18.5,9.33 16,9.33 | DS18B20Z.5 63.4,45.8 DS18B20Z.HEAT 70,47.7 80.45,47.7 80.65,47.5 | U$22.2 66.67,61.46 69.2,64 U$22.4 69.2,59.16 R2.1 R1.1
  Top 0.5: R18.2 7.35,65.1 SI2302-1.2 6.25,68.2 0.83,68.2 0.83,68.5 | 69.2,65.3 70.31,64.2 FS8205.HEAT | U$22.5 69.2,65.3 | 69.2,65.3 69.2,64
  Top 0.6: v40.8,65.2 SI2302-6.2 | SI2302-5.2 v42.8,43.2 | SI2302-3.2 v40.8,21.2 | SI2302-4.2 v40.8,32.2 | SI2302-7.2 v40.8,76.2 | SI2302-8.2 41,87.2 40.8,87 | R1.1 70,53.05 70,47.7
  Top 0.8: SI2302-2.2 11.8,33.15 R20.2 9.45,31 0.83,31 | 43.21,4.95 43.21,11.61 | 43.21,11.61 v43.4,11.8 | v41.9,11.8 43.02,11.8 43.21,11.61 | 80.65,58.8 80.65,59.5
  Top 1: FS8205.HEAT FS8205.23 71.6,58.8 80.65,58.8 | 40.8,96.5 42.27,96.5 | 42.27,96.5 48.4,96.5 48.45,96.45 66,96.45 66,90.67 66.5,90.17 80.65,90.17 80.65,59.5 80.65,47.5 80.65,9.85 66.35,9.85 65.85,9.35 65.85,4.95 44.81,4.95 | BKU.11 42.27,96.5 | BKU.9 37.19,96.5 | 37.19,96.5 40.8,96.5 | 37.19,96.5 15.5,96.5 15.5,90.67 0.83,90.67 0.83,68.5 0.83,31 0.83,9.33 16,9.33 16,1.25 BSK5.1 32.11,4.95 39.73,4.95 | 44.81,4.95 43.21,4.95 39.73,4.95 | BSK5.6 44.81,4.95 | BSK5.4 39.73,4.95 | 40.8,96.5 40.8,87 v40.8,85.2
  Bottom 0.6: v40.8,85.2 40.8,83.97 40.99,83.77 40.99,80.19 40.8,80 v40.8,76.2 40.8,72.97 40.99,72.77 40.99,69.19 40.8,69 v40.8,65.2 40.8,64.5 43.53,61.77 43.53,58.19 40.15,54.8 37.22,54.8 35.46,53.04 35.46,45.83 40.99,40.3 | 40.99,40.3 40.99,36.19 40.8,35.99 v40.8,32.2 40.8,28.96 40.99,28.77 40.99,25.19 40.8,25 v40.8,21.2 | v42.8,43.2 42.8,42.11 40.99,40.3
  cutout Top: 13.06,71.45 15.06,69.45 21.56,75.95 19.56,77.95
  pour Top (isolate 0.3, rank 2, no thermals): 0,91.5 14.9,91.5 14.9,100 67.1,100 67.1,91.5 82,91.5 82,8.5 67,8.5 67,0 15,0 15,8.4 14.9,8.5 0,8.5
  cutout Top: 28.55,69.95 21,62.4 23.45,59.95 31,67.5
  pour Bottom (no thermals): 44.8,85.5 40.5,85.5 40.5,12 44.8,12
  cutout Bottom: 40.5,54.5 45,54.5 45,45.5 40.5,45.5
GND1
  cutout Top: 21,37.6 28.55,30.05 31,32.5 23.45,40.05
GND2
  cutout Top: 58.6,40 51.1,32.5 53.55,30.05 61.05,37.55
GND3
  cutout Top: 51.2,67.5 58.6,60.1 61.05,62.55 53.65,69.95
HEAT1
  cutout Top: 60.44,24.06 62.44,22.06 68.94,28.56 66.94,30.56
HEAT2
  cutout Top: 66.96,69.43 68.96,71.43 62.46,77.93 60.46,75.93
HEAT3
  cutout Top: 19.57,22.05 21.57,24.05 15.07,30.55 13.07,28.55
N$1
  Top 0.3: R4.2 73.95,67.2 | 73.95,67.2 R5.1 | FS8205.5 73.95,67.2
N$2
  Top 0.3: LED-B.C 10.15,67.9 R11.1
N$3
  Top 0.3: LED-R.C 11.1,38.45 R19.1
N$4
  Top 0.3: LED-G1.A R16.2
N$5  (via drill 1)
  other vias: 68.1,6.9
N$6  (via drill 1)
  other vias: 68.1,1.1
N$7  (via drill 1)
  other vias: 73.9,1.1
N$8  (via drill 1)
  other vias: 73.9,6.9
N$9  (via drill 1)
  other vias: 8.1,98.9
N$10  (via drill 1)
  other vias: 8.1,93.1
N$11  (via drill 1)
  other vias: 8.1,6.9
N$12  (via drill 1)
  other vias: 8.1,1.1
N$13  (via drill 1)
  other vias: 13.9,1.1
N$14  (via drill 1)
  other vias: 13.9,6.9
N$15  (via drill 1)
  other vias: 13.9,93.1
N$16  (via drill 1)
  other vias: 13.9,98.9
N$17  (via drill 1)
  other vias: 68.1,98.9
N$18  (via drill 1)
  other vias: 68.1,93.1
N$19  (via drill 1)
  other vias: 73.9,93.1
N$20  (via drill 1)
  other vias: 73.9,98.9
N$21
  Top 0.3: LED-G3.A R17.2
N$22
  Top 0.3: LED-G4.A 50.4,44.55 50.4,45.3 50.35,45.35 50.2,45.5 48.91,45.5 48.01,44.6 R21.2
N$23
  Top 0.3: R22.2 LED-G5.A
N$24
  Top 0.3: LED-G6.A R23.2
N$25
  Top 0.3: R24.1 64.25,56.16 63.4,57.01 63.4,58.51 65.19,60.3 U$22.1
  Top 0.5: R1.2 R24.1
N$26
  Top 0.3: U$22.3 67.94,59.59 R2.2
  Top 0.5: R2.2 R25.1
N$27
  Top 0.3: R7.1 73.95,61.2 | 73.95,61.2 R3.1 | FS8205.4 73.95,61.2
N$28
  Top 0.8: R10.2 20.45,80.65 LED_Y.A
N$29
  Top 0.3: SI2302-4.1 43.85,32.1 R13.1 45.7,31.75 45.7,31.2 46.24,30.66 46.24,27.79 46.89,27.14 50.31,27.14 51.32,26.13 51.32,25.25 55.47,21.1 R26.1
N$30
  Top 0.3: SI2302-6.1 43.85,65.1 R9.2 46.2,65.1 46.2,72.7 50.5,77 54.75,77 R27.1
N$31
  Top 0.3: SI2302-8.1 45.25,87.2 R6.2 46.25,86.2 47.7,86.2 47.87,86.38 52.58,86.38 53.54,85.41 53.54,82.41 54.65,81.3 R28.1
N$32
  Top 0.3: SI2302-3.1 45.25,21.2 R14.2 47.45,19 R31.1
N$34
  Top 0.3: SI2302-7.1 43.85,76.1 R8.1 46.2,76.95 46.2,78.89 46.41,79.1 47.7,79.1 54.75,79.1 R29.1
N$35
  Top 0.3: R12.2 46.45,42.5 SI2302-5.1 46.2,42.75 46.2,31.41 48.1,29.5 54.29,29.5 56.35,27.44 R30.1
N$36
  Top 0.3: R32.1 5.55,64.5 R18.1 5.45,65.1 SI2302-1.1
N$37
  Top 0.3: R33.1 R20.1 11.8,35.05 SI2302-2.1
N$38
  Top 0.3: LED-G2.A R15.2
N$150
  Top 0.3: R76.2 24.9,14.15 C41.1 23.57,15.47 INA.1
N$151
  Top 0.3: R77.2 20.5,14.15 C41.2 22.93,14.43 INA.2
OC2  (via drill 0.35)
  Top 0.3: R3.2 75.65,60.95 76.5,61.8 76.5,68.8 75.42,69.88 71.13,69.88 v71.05,69.95 | v67.9,67.88 67.94,67.84 U$22.6
  Bottom 0.3: v67.9,67.88 69.2,69.18 70.28,69.18 v71.05,69.95
OD2  (via drill 0.35)
  Top 0.3: R5.2 74.65,69.1 v71.9,69.1 | v65.4,67.5 v65.39,67.5 U$22.8
  Bottom 0.3: v71.9,69.1 69.8,67 65.9,67 v65.4,67.5
PL1
  Bottom 0.3: JP6.17 49.89,18.11 48.78,19.23 48.78,26.27 49.89,27.39 JP5.17 49.89,29.11 48.78,30.23 48.78,37.27 49.89,38.38 JP4.17 49.89,57.12 48.78,58.23 48.78,59.27 49.89,60.38 JP3.17 49.89,62.12 48.78,63.23 48.78,70.27 49.89,71.39 JP2.17 49.89,73.11 48.78,74.23 48.78,81.17 49.89,82.28 JP1.17
PL1-GND
  Top 0.3: LED-G1.C 42.05,88.14 42.6,87.59 42.6,85.4 SI2302-8.3
  Top 0.6: SI2302-8.3 42.8,83.78 JP1.11 JP1.12
PL1-KVCC  (via drill 0.35 pad 0.65)
  Top 0.3: v57.8,81.3 R28.2
  Bottom 0.3: BKU.15 52.7,98.48 52.7,86.79 57.8,81.69 v57.8,81.3
PL2
  Bottom 0.3: JP1.18 49.89,73.82 51,72.71 51,71.79 49.89,70.68 JP2.18 49.89,62.82 51,61.71 51,60.79 49.89,59.68 JP3.18 49.89,57.82 50.39,57.32 50.39,40.61 51,40 51,38.79 49.89,37.68 JP4.18 49.89,29.82 51,28.71 51,27.79 49.89,26.68 JP5.18 49.89,18.82 51,17.71 51,16.79 49.89,15.68 JP6.18
PL2-GND
  Top 0.3: SI2302-7.3 42.8,75.3 42.62,75.48 42.62,77.13 42.3,77.45 42.3,77.95 LED-G2.C
  Top 0.6: SI2302-7.3 42.8,72.78 JP2.11 JP2.12
PL2-KVCC  (via drill 0.35 pad 0.65)
  Top 0.3: v57.8,79.2 R29.2
  Bottom 0.3: BKU.16 53.2,96.98 53.2,86.99 58.58,81.62 58.58,79.97 v57.8,79.2
PL3
  Bottom 0.3: JP6.19 52.43,18.11 51.32,19.23 51.32,26.27 52.43,27.39 JP5.19 52.43,29.11 51.1,30.45 51.1,36.95 52.43,38.28 JP4.19 51.5,40.18 51.5,40.21 50.89,40.82 50.89,58.14 51,58.25 51,59.82 JP3.19 51,62.68 51,70.17 51,70.82 JP2.19 52.43,73.11 51.32,74.23 51.32,81.17 52.43,82.28 JP1.19
PL3-GND
  Top 0.3: SI2302-6.3 42.8,64.3 42.62,64.48 42.62,66.13 42.3,66.45 42.3,66.95 LED-G3.C
  Top 0.6: SI2302-6.3 42.8,61.78 JP3.11
  Bottom 0.6: JP3.11 JP3.12
PL3-KVCC  (via drill 0.35 pad 0.65)
  Top 0.3: R27.2 v57.8,77.1
  Bottom 0.3: v57.8,77.1 57.8,78.1 59.08,79.38 59.08,81.83 53.7,87.2 53.7,94.94 BKU.17
PL4
  Bottom 0.3: JP6.20 52.43,15.68 53.54,16.79 53.54,17.71 52.43,18.82 JP5.20 52.43,26.68 53.54,27.79 53.54,28.71 51.6,30.65 51.6,35.37 52.43,36.2 JP4.20 52.43,37.58 53.54,38.69 53.54,39.71 51.64,41.61 51.64,54.85 52.43,55.64 JP3.20 52.43,59.68 53.54,60.79 53.54,61.96 51.5,64 51.5,68.78 52.36,69.64 JP2.20 52.43,70.68 53.54,71.79 53.54,72.71 52.43,73.82 JP1.20
PL4-GND
  Top 0.3: LED-G4.C 50.45,46 47.7,46 46.1,44.4 45.81,44.4 44.8,43.39 SI2302-5.3
  Top 0.6: SI2302-5.3 43.2,41.2 42.27,40.27 JP4.11 JP4.12
PL4-KVCC  (via drill 0.35 pad 0.65)
  Top 0.3: R30.2 v59.5,23.2
  Bottom 0.3: BKU.18 60.05,98.04 67.41,90.68 72.87,90.68 78.88,84.68 80.32,83.23 80.32,24.73 71.09,15.5 67.2,15.5 v59.5,23.2
PL5-GND
  Top 0.3: SI2302-4.3 42.8,31.3 42.62,31.48 42.62,33.13 42.3,33.45 42.3,33.95 LED-G5.C
  Top 0.6: JP5.12 JP5.11 42.8,28.78 SI2302-4.3
PL5-KVCC  (via drill 0.35 pad 0.65)
  Top 0.3: R26.2 v59.5,21.1
  Bottom 0.3: 80.82,83.44 76.88,87.38 | 76.88,87.38 80.82,83.45 80.82,83.44 | BKU.19 62.59,96.2 67.59,91.2 73.07,91.2 76.88,87.38 | v59.5,21.1 65.6,15 71.29,15 80.82,24.53 80.82,83.44
PL6-GND
  Top 0.3: SI2302-3.3 42.8,20.3 42.62,20.48 42.62,22.13 42.3,22.45 42.3,22.95 LED-G6.C
  Top 0.6: SI2302-3.3 42.8,17.78 JP6.11 JP6.12
PL6-KVCC  (via drill 0.35 pad 0.65)
  Top 0.3: v59.5,19 R31.2
  Bottom 0.3: BKU.20 65.13,94.37 67.8,91.7 73.27,91.7 81.32,83.65 81.32,24.32 71.5,14.5 64,14.5 v59.5,19
SCL-TM  (via drill 0.6 pad 0.35, 0.6 pad 0.65)
  Top 0.3: v39.55,91.8 39.95,92.2 39.95,94 38.7,95.25 v38.2,95.25 | JP6.13 43.38,15.82 43.38,14.25 42.73,13.6 29.2,13.6 24.12,8.52 23.11,8.52 21.62,10.01 INA.5
  Bottom 0.3: BKU.10 38.23,97.25 38.23,95.28 v38.2,95.25 | v39.55,91.8 39.55,90.42 43.48,86.48 43.48,84.58 JP1.13 44.81,82.39 43.7,81.27 43.7,80.25 44.31,79.64 44.31,73.61 44.81,73.11 JP2.13 44.81,71.39 43.7,70.27 43.7,69.25 44.31,68.64 44.31,62.62 44.81,62.12 JP3.13 45.92,60.14 45.92,58.25 45.66,57.99 45.66,45.5 44.81,44.65 JP4.13 44.81,38.38 43.7,37.27 43.7,36.25 44.31,35.64 44.31,29.61 44.81,29.11 JP5.13 44.81,27.39 43.7,26.27 43.7,25.25 44.31,24.64 44.31,18.61 44.81,18.11 JP6.13 44.81,16.39 43.7,15.27 43.7,14.25 44.31,13.64 44.31,3.29 BSK5.5
SDA-TM  (via drill 0.35, 0.6 pad 0.65)
  Top 0.3: v44.5,85.5 44.31,85.5 43.1,86.71 43.1,87.8 42.8,88.1 42.8,89.75 42.55,90 41.65,90 41.65,95.15 41.75,95.25 v45.55,95.25 | JP6.14 43.17,13.07 29.38,13.07 24.33,8.02 22.9,8.02 21.07,9.85 21.07,11.1 21.28,11.3 21.97,11.3 22.27,10.99 INA.6 | JP2.14 43.05,67.95 43.01,67.95 42.8,67.75 42.8,66.66 43.12,66.33 43.12,64.69 43.7,64.11 43.7,60.69 44.81,59.58 JP3.14 46.37,57.15 46.43,57.15 47.08,56.5 v47.5,56.5
  Bottom 0.3: BKU.12 45.55,98.01 v45.55,95.25 | v44.5,85.5 45.92,84.08 45.92,82.79 44.81,81.68 JP1.14 44.81,73.82 45.92,72.71 45.92,71.79 44.81,70.68 JP2.14 | v47.5,56.5 46.16,56.5 46.16,45 45.31,44.15 45.31,40.32 45.92,39.71 45.92,38.79 44.81,37.68 JP4.14 44.81,29.82 45.92,28.71 45.92,27.79 44.81,26.68 JP5.14 44.81,18.82 45.92,17.71 45.92,16.79 44.81,15.68 JP6.14 44.81,3.79 BSK5.7
SP+
  Top 0.3: 69.16,21.84 65,21.84 U$20.3 | 69.16,21.84 69.16,26 U$20.1 | U$20.P$2 69.16,21.84 | U$20.P$2 69.28,21.71 | 69.28,21.71 U$20.2 | U$20.P$2 69.28,21.71 | 69.28,21.71 U$20.4
SP+1
  Top 0.3: 12.48,78.52 8.06,78.52 U$1.2 | 12.74,78 12.74,78.26 U$1.P$2 | 12.74,78 12.74,73.84 U$1.1 | 12.48,78.52 12.48,82.94 U$1.4 | 12.74,78 17.16,78 U$1.3 | 12.74,78 U$1.P$2 | 12.48,78.52 U$1.P$2
SP+2
  Top 0.3: 69.16,78 69.16,78.26 U$3.P$2 | 69.16,78 69.16,73.84 U$3.3 | 69.16,78 65,78 U$3.1 | 69.16,78 U$3.P$2 | 69.68,78.78 69.68,82.94 U$3.2 | 69.68,78.78 69.42,78.52 U$3.P$2 | 69.68,78.78 73.84,78.78 U$3.4 | 69.68,78.78 U$3.P$2
SP+3
  Top 0.3: 12.22,21.32 8.06,21.32 U$18.4 | 12.22,21.32 12.48,21.58 U$18.P$2 | 12.22,21.32 12.22,17.16 U$18.2 | 12.22,21.32 U$18.P$2 | 13,21.84 12.74,21.84 U$18.P$2 | 13,21.84 17.16,21.84 U$18.1 | 13,21.84 13,26 U$18.3 | 13,21.84 U$18.P$2 | R77.1 19.7,18.5 R75.1
  Top 1: R75.1 19.9,20.19 U$18.1
SP-
  Top 0.3: 21.12,74.1 U$2.4 21.2,69.8 U$2.P$2 | U$2.P$2 17.31,69.44 U$2.2 | U$2.P$2 25.8,69.44 U$2.3 | U$2.P$2 21.91,69.09 U$2.1
  Top 1: LED_Y.C 24.27,74.1 21.12,74.1
SP-1
  Top 0.3: 60.58,69.68 60.84,69.68 U$4.P$2 | 60.58,69.68 56.42,69.68 U$4.1 | 60.58,69.68 60.58,65.52 U$4.3 | 60.58,69.68 U$4.P$2 | 61.36,70.2 65.26,70.2 U$4.4 | 61.36,70.2 61.1,69.94 U$4.P$2 | 61.36,70.2 61.36,74.36 U$4.2 | 61.36,70.2 U$4.P$2 | U$22.7 66.67,69.2 | 66.67,69.2
  Top 1: FS8205.67 71.53,67.28 71.53,67.89 70.21,69.2 66.67,69.2 65.67,69.2 65.07,69.8 U$4.4
SP-2
  Top 0.3: 20.8,29.64 20.8,25.74 U$19.2 | 20.8,29.64 21.06,29.9 U$19.P$2 | 20.8,29.64 16.64,29.64 U$19.4 | 20.8,29.64 U$19.P$2 | 21.32,30.42 21.32,30.16 U$19.P$2 | 21.32,30.42 21.32,34.58 U$19.3 | 21.32,30.42 25.48,30.42 U$19.1 | 21.32,30.42 U$19.P$2
SP-3
  Top 0.3: 61.1,29.64 61.1,29.9 U$21.P$2 | 61.1,29.64 61.1,25.74 U$21.4 | 61.1,29.64 65.26,29.64 U$21.2 | 61.1,29.64 U$21.P$2 | 60.58,30.42 56.42,30.42 U$21.3 | 60.58,30.42 60.58,34.58 U$21.1 | 60.58,30.42 60.84,30.16 U$21.P$2
TIME  (via drill 0.35, 0.6 pad 0.65)
  Top 0.3: JP1.15 49.58,85.48 v52.2,85.48 | JP3.15 47.35,60.28 48.46,59.17 48.46,56.37 48.23,56.14 v48.23,55.73
  Bottom 0.3: BKU.14 52.2,96.44 v52.2,85.48 | JP1.15 47.35,82.39 46.24,81.27 46.24,74.23 47.35,73.11 JP2.15 47.35,71.39 46.24,70.27 46.24,63.23 47.35,62.12 JP3.15 | v48.23,55.73 46.66,54.16 46.66,39.94 JP4.15 47.35,38.38 46.24,37.27 46.24,30.23 47.35,29.12 JP5.15 47.35,27.38 46.24,26.27 46.24,19.23 47.35,18.12 JP6.15
TIME-ES
  Top 0.3: BKU.13 48.8,97.3 66.56,97.3 66.85,97.01 66.85,91.02 81.48,91.02 81.5,91 81.5,9 67,9 67,0.48 53.52,0.48 53.5,0.5 50.64,0.5 BSK5.8

### Text on the board
tNames: HEATER
bNames: to BKU | BUS+ | BUS+ | BUS- | BUS- | CMD | BUS- | BUS- | BUS+ | BUS+ | to BSK5